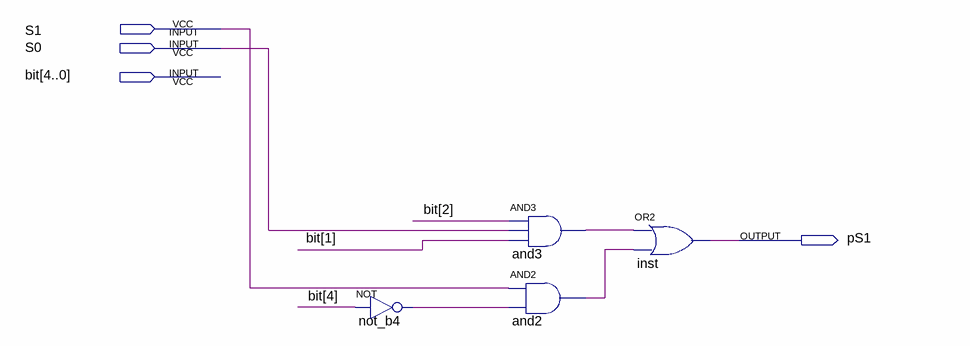
[diagram p0: schematic sheet]
// Quartus schematic prox_s1.bdf as structural Verilog: 4 symbols, 4 pins
module prox_s1 (
  input  S1,
  input  S0,
  input  [4:0] \bit ,
  output pS1
);

  wire and2_out, and3_out, not_b4_out;

  not not_b4 (not_b4_out, \bit [4]);
  and and3 (and3_out, \bit [2], S0, \bit [1]);
  and and2 (and2_out, S1, not_b4_out);
  or inst (pS1, and3_out, and2_out);
endmodule
